# Altium schematic sheet Sheet2.SchDoc
size A4
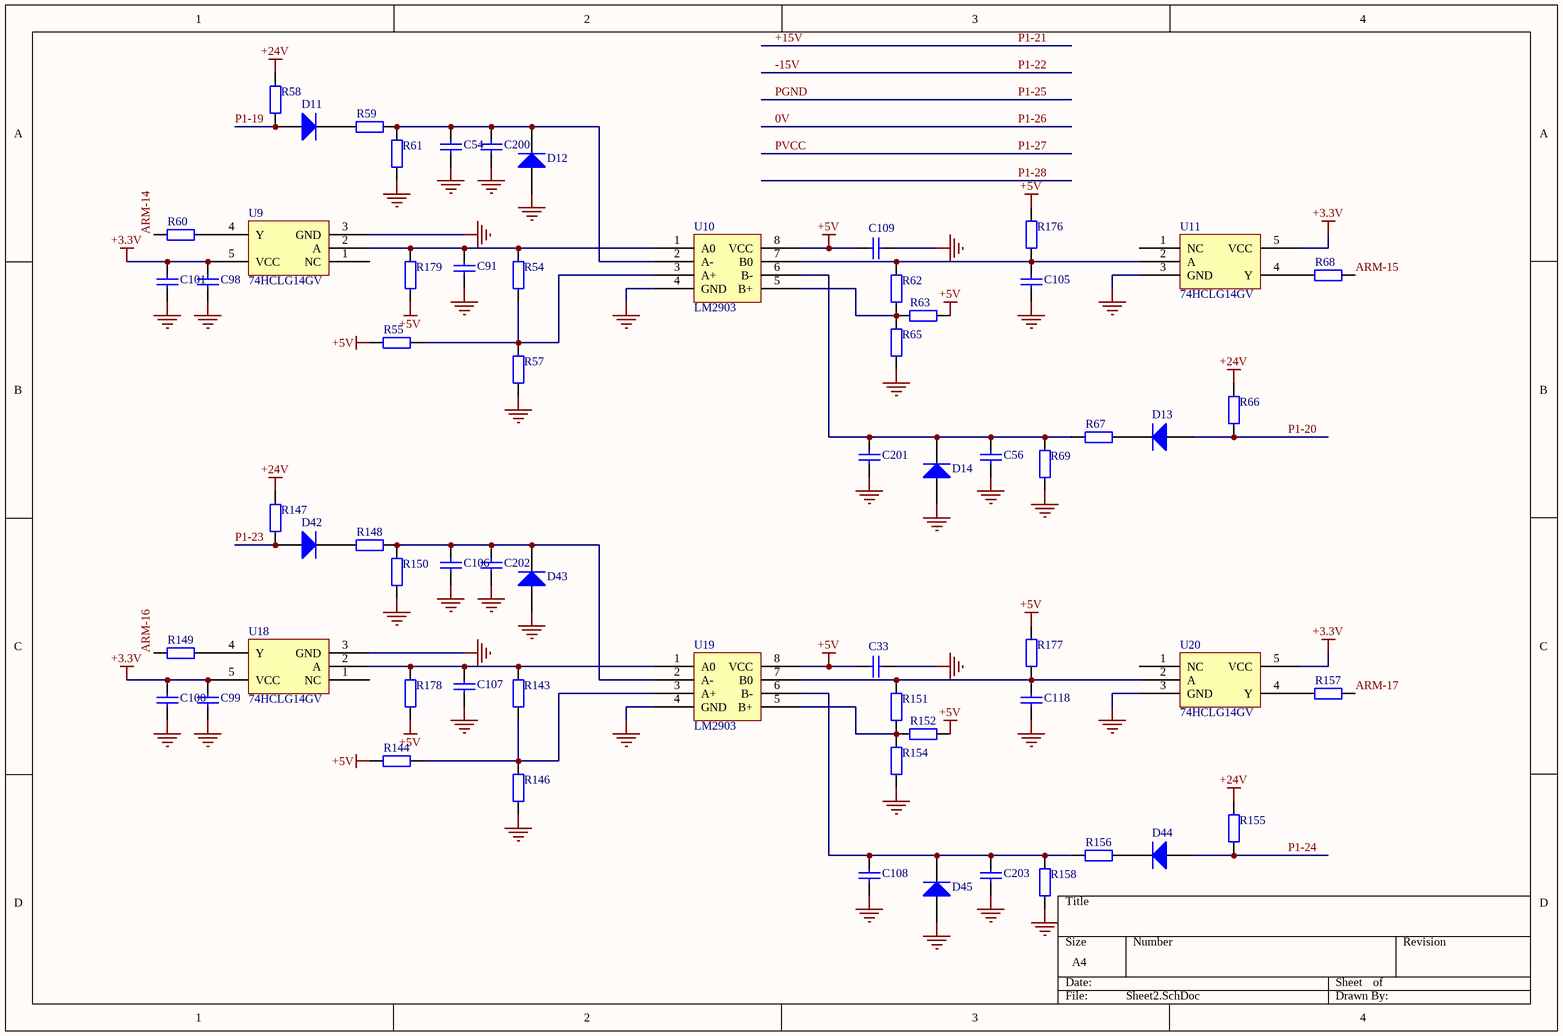
[diagram p0: Sheet2.SchDoc]

## Parts
C33  Cap  [RAD-0.3]  (value not drawn)
C54  Cap  [RAD-0.3]  (value not drawn)
C56  Cap  [RAD-0.3]  (value not drawn)
C91  Cap  [RAD-0.3]  (value not drawn)
C98  Cap  [RAD-0.3]  (value not drawn)
C99  Cap  [RAD-0.3]  (value not drawn)
C100  Cap  [RAD-0.3]  (value not drawn)
C101  Cap  [RAD-0.3]  (value not drawn)
C105  Cap  [RAD-0.3]  (value not drawn)
C106  Cap  [RAD-0.3]  (value not drawn)
C107  Cap  [RAD-0.3]  (value not drawn)
C108  Cap  [RAD-0.3]  (value not drawn)
C109  Cap  [RAD-0.3]  (value not drawn)
C118  Cap  [RAD-0.3]  (value not drawn)
C200  Cap  [RAD-0.3]  (value not drawn)
C201  Cap  [RAD-0.3]  (value not drawn)
C202  Cap  [RAD-0.3]  (value not drawn)
C203  Cap  [RAD-0.3]  (value not drawn)
D11  Diode 1N4007  [DO-41]  (value not drawn)
D12  Diode 1N4007  [DO-41]  (value not drawn)
D13  Diode 1N4007  [DO-41]  (value not drawn)
D14  Diode 1N4007  [DO-41]  (value not drawn)
D42  Diode 1N4007  [DO-41]  (value not drawn)
D43  Diode 1N4007  [DO-41]  (value not drawn)
D44  Diode 1N4007  [DO-41]  (value not drawn)
D45  Diode 1N4007  [DO-41]  (value not drawn)
R54  Res2  [AXIAL-0.4]  (value not drawn)
R55  Res2  [AXIAL-0.4]  (value not drawn)
R57  Res2  [AXIAL-0.4]  (value not drawn)
R58  Res2  [AXIAL-0.4]  (value not drawn)
R59  Res2  [AXIAL-0.4]  (value not drawn)
R60  Res2  [AXIAL-0.4]  (value not drawn)
R61  Res2  [AXIAL-0.4]  (value not drawn)
R62  Res2  [AXIAL-0.4]  (value not drawn)
R63  Res2  [AXIAL-0.4]  (value not drawn)
R65  Res2  [AXIAL-0.4]  (value not drawn)
R66  Res2  [AXIAL-0.4]  (value not drawn)
R67  Res2  [AXIAL-0.4]  (value not drawn)
R68  Res2  [AXIAL-0.4]  (value not drawn)
R69  Res2  [AXIAL-0.4]  (value not drawn)
R143  Res2  [AXIAL-0.4]  (value not drawn)
R144  Res2  [AXIAL-0.4]  (value not drawn)
R146  Res2  [AXIAL-0.4]  (value not drawn)
R147  Res2  [AXIAL-0.4]  (value not drawn)
R148  Res2  [AXIAL-0.4]  (value not drawn)
R149  Res2  [AXIAL-0.4]  (value not drawn)
R150  Res2  [AXIAL-0.4]  (value not drawn)
R151  Res2  [AXIAL-0.4]  (value not drawn)
R152  Res2  [AXIAL-0.4]  (value not drawn)
R154  Res2  [AXIAL-0.4]  (value not drawn)
R155  Res2  [AXIAL-0.4]  (value not drawn)
R156  Res2  [AXIAL-0.4]  (value not drawn)
R157  Res2  [AXIAL-0.4]  (value not drawn)
R158  Res2  [AXIAL-0.4]  (value not drawn)
R176  Res2  [AXIAL-0.4]  (value not drawn)
R177  Res2  [AXIAL-0.4]  (value not drawn)
R178  Res2  [AXIAL-0.4]  (value not drawn)
R179  Res2  [AXIAL-0.4]  (value not drawn)
U9  74HCLG14GV
U10  LM2903
U11  74HCLG14GV
U18  74HCLG14GV
U19  LM2903
U20  74HCLG14GV

## Nets
+3.3V: C98.2 C99.2 C100.2 C101.2 U9.5(VCC) U11.5(VCC) U18.5(VCC) U20.5(VCC)
+5V: C33.2 C109.2 R55.2 R63.1 R144.2 R152.1 R176.1 R177.1 R178.2 R179.2 U10.8(VCC) U19.8(VCC)
+24V: R58.2 R66.2 R147.2 R155.2
GND: C33.1 C54.1 C56.2 C91.1 C98.1 C99.1 C100.1 C101.1 C105.2 C106.1 C107.1 C108.2 C109.1 C118.2 C200.1 C201.2 C202.1 C203.2 D12.1(A) D14.1(A) D43.1(A) D45.1(A) R57.2 R61.1 R65.2 R69.1 R146.2 R150.1 R154.2 R158.1 U9.3(GND) U10.4(GND) U11.3(GND) U18.3(GND) U19.4(GND) U20.3(GND)
ARM-14: R60.1
ARM-15: R68.2
ARM-16: R149.1
ARM-17: R157.2
P1-19: D11.1(A) R58.1
P1-20: D13.1(A) R66.1
P1-23: D42.1(A) R147.1
P1-24: D44.1(A) R155.1
NetC54_2: C54.2 C200.2 D12.2(K) R59.1 R61.2 U10.2(A-)
NetC56_1: C56.1 C201.1 D14.2(K) R67.2 R69.2 U10.6(B-)
NetC91_2: C91.2 R54.2 R179.1 U9.2(A) U10.1(A0)
NetC105_1: C105.1 R62.1 R176.2 U10.7(B0) U11.2(A)
NetC106_2: C106.2 C202.2 D43.2(K) R148.1 R150.2 U19.2(A-)
NetC107_2: C107.2 R143.2 R178.1 U18.2(A) U19.1(A0)
NetC108_1: C108.1 C203.1 D45.2(K) R156.2 R158.2 U19.6(B-)
NetC118_1: C118.1 R151.1 R177.2 U19.7(B0) U20.2(A)
NetD11_2: D11.2(K) R59.2
NetD13_2: D13.2(K) R67.1
NetD42_2: D42.2(K) R148.2
NetD44_2: D44.2(K) R156.1
NetR54_1: R54.1 R55.1 R57.1 U10.3(A+)
NetR60_2: R60.2 U9.4(Y)
NetR62_2: R62.2 R63.2 R65.1 U10.5(B+)
NetR68_1: R68.1 U11.4(Y)
NetR143_1: R143.1 R144.1 R146.1 U19.3(A+)
NetR149_2: R149.2 U18.4(Y)
NetR151_2: R151.2 R152.2 R154.1 U19.5(B+)
NetR157_1: R157.1 U20.4(Y)

Not connected (* = marked no-connect by the designer): U9 1(NC); U11 1(NC); U18 1(NC); U20 1(NC)

## Library data of the parts
C33 C54 C56 C91 C98-C101 C105-C109 C118 C200-C203 = Cap: Capacitor; Value: 100pF; Published: 8-Jun-2000; LatestRevisionDate: 17-Jul-2002; LatestRevisionNote: Re-released for DXP Platform.; PackageReference: RAD-0.3; Publisher: Altium Limited
D11-D14 D42-D45 = Diode 1N4007: 1 Amp General Purpose Rectifier; Published: 8-Jun-2000; LatestRevisionDate: 17-Jul-2002; LatestRevisionNote: Re-released for DXP Platform.; DatasheetDocument: 1998; PackageDocument: Aug-1999; PackageReference: DO-41; Publisher: Altium Limited; Code_JEDEC: DO-204-AL; ComponentLink1Description: Manufacturer Link; ComponentLink1URL: http://www.fairchildsemi.com/; ComponentLink2Description: Datasheet; ComponentLink2URL: http://www.fairchildsemi.com/ds/1N%2F1N4001.pdf
R54 R55 R57-R63 R65-R69 R143 R144 R146-R152 R154-R158 R176-R179 = Res2: Resistor; Value: 1K; Published: 8-Jun-2000; LatestRevisionDate: 17-Jul-2002; LatestRevisionNote: Re-released for DXP Platform.; PackageReference: AXIAL-0.4; Publisher: Altium Limited
U9-U11 U18-U20 = Component_1